# Altium schematic sheet Microcontroller_schematic.SchDoc
size B; SheetNumber: 1; SheetTotal: 1
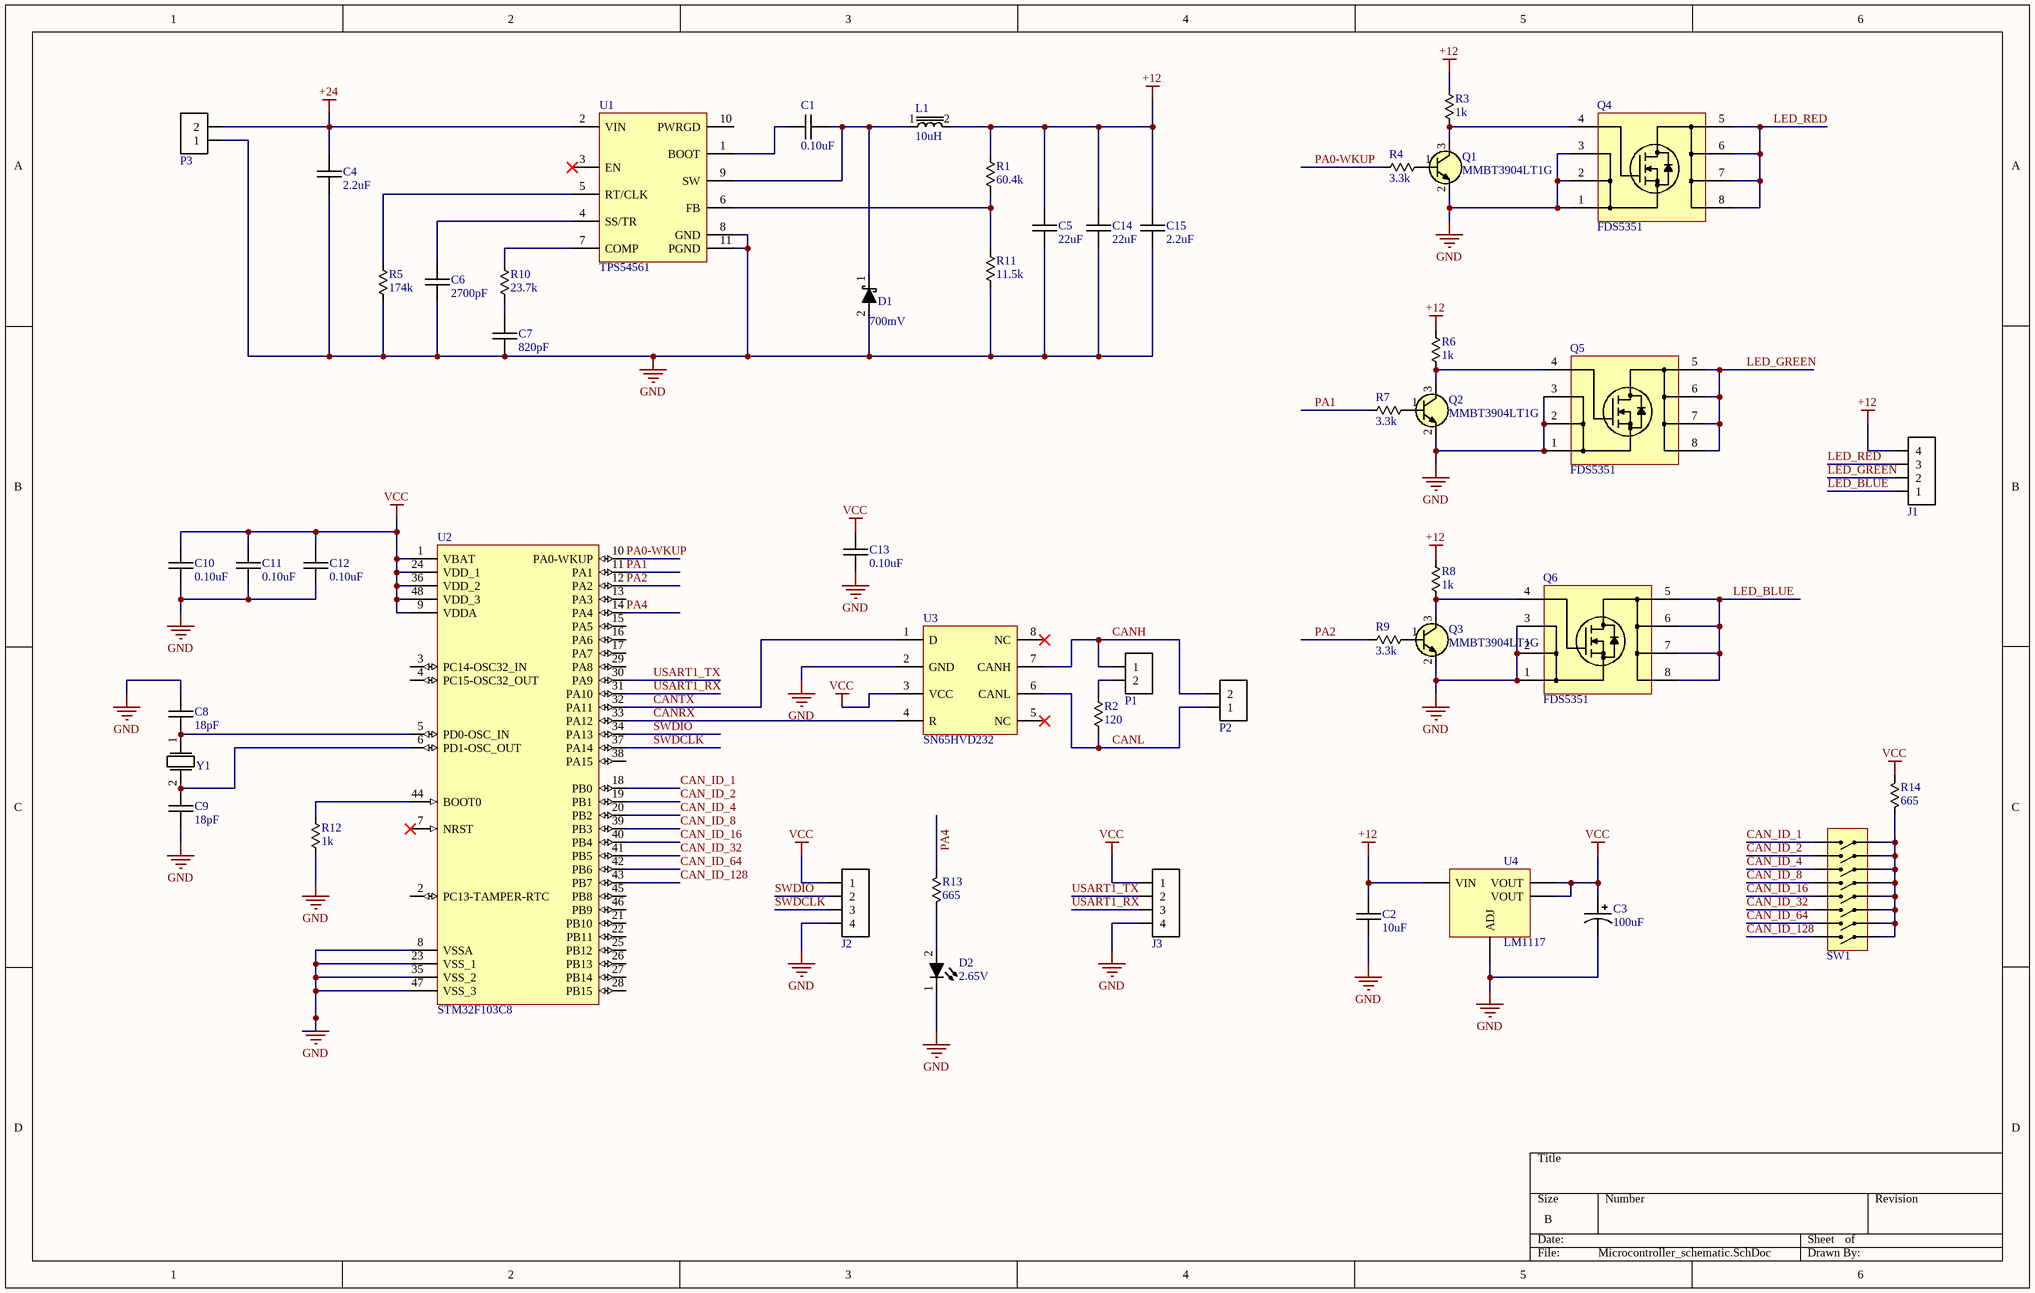
[diagram p0: Microcontroller_schematic.SchDoc]

## Parts
C1  0.10uF  [chip_0805]
C2  10uF  [chip_1206]
C3  100uF  [chip_2917_AVX_TAJD]
C4  2.2uF  [chip_1206]
C5  22uF  [chip_1206]
C6  2700pF  [chip_0805]
C7  820pF  [chip_0805]
C8  18pF  [chip_0603]
C9  18pF  [chip_0603]
C10  0.10uF  [chip_0805]
C11  0.10uF  [chip_0805]
C12  0.10uF  [chip_0805]
C13  0.10uF  [chip_0805]
C14  22uF  [chip_1206]
C15  2.2uF  [chip_1206]
D1  700mV  [do-214ab]
D2  2.65V  [chip_0603_LED]
J1  conn-4x1_0  [TERM_3.50MM_4x1_0]  (value not drawn)
J2  conn-4x1_0  [HDDR_4x1_0]  (value not drawn)
J3  conn-4x1_0  [HDDR_4x1_0]  (value not drawn)
L1  Inductance: 10uH  [VISHAY_IHLP3232DZ]  (hidden comment: ind_1)
P1  conn-2x1_0  [HDDR_2x1_0]  (value not drawn)
P2  conn-2x1_0  [TERM_3.50MM_2x1_0]  (value not drawn)
P3  conn-2x1_0  [TERM_3.50MM_2x1_0]  (value not drawn)
Q1  MMBT3904LT1G  [SOT-23-3_1]
Q2  MMBT3904LT1G  [SOT-23-3_1]
Q3  MMBT3904LT1G  [SOT-23-3_1]
Q4  FDS5351  [SO-8]
Q5  FDS5351  [SO-8]
Q6  FDS5351  [SO-8]
R1  60.4k  [chip_0805]
R2  120  [chip_0805]
R3  1k  [chip_0805]
R4  3.3k  [chip_0603]
R5  174k  [chip_0805]
R6  1k  [chip_0805]
R7  3.3k  [chip_0603]
R8  1k  [chip_0805]
R9  3.3k  [chip_0603]
R10  23.7k  [chip_0805]
R11  11.5k  [chip_0805]
R12  1k  [chip_0805]
R13  665  [chip_0805]
R14  665  [chip_0805]
SW1  DIP_SW_8  [A6S-8104-H]  (value not drawn)
U1  TPS54561  [WSON-10_0]
U2  STM32F103C8  [LQFP48_0]
U3  SN65HVD232  [SO-8]
U4  LM1117  [sot-223-4]
Y1  osc_xtal_2p_0  [ABLS_AT49_OSC]  (value not drawn)

## Nets
+12: C2.1 C5.1 C14.1 C15.1 J1.4 L1.2 R1.1 R3.1 R6.1 R8.1 U4.3(VIN)
+24: C4.1 P3.2 U1.2(VIN)
GND: C2.2 C3.2 C4.2 C5.2 C6.2 C7.2 C8.1 C9.2 C10.1 C11.2 C12.1 C13.1 C14.2 C15.2 D1.2 D2.1 J2.4 J3.4 P3.1 Q1.2(E) Q2.2(E) Q3.2(E) Q4.1(S) Q4.2(S) Q4.3(S) Q5.1(S) Q5.2(S) Q5.3(S) Q6.1(S) Q6.2(S) Q6.3(S) R5.2 R11.2 R12.2 U1.8(GND) U1.11(PGND) U2.8(VSSA) U2.23(VSS_1) U2.35(VSS_2) U2.47(VSS_3) U3.2(GND) U4.1(ADJ)
VCC: C3.1 C10.2 C11.1 C12.2 C13.2 J2.1 J3.1 R14.2 U2.1(VBAT) U2.9(VDDA) U2.24(VDD_1) U2.36(VDD_2) U2.48(VDD_3) U3.3(VCC) U4.2(VOUT) U4.4(VOUT)
CAN_ID_1: SW1.9 U2.18(PB0)
CAN_ID_2: SW1.10 U2.19(PB1)
CAN_ID_4: SW1.11 U2.20(PB2)
CAN_ID_8: SW1.12 U2.39(PB3)
CAN_ID_16: SW1.13 U2.40(PB4)
CAN_ID_32: SW1.14 U2.41(PB5)
CAN_ID_64: SW1.15 U2.42(PB6)
CAN_ID_128: SW1.16 U2.43(PB7)
CANH: P1.1 P2.2 U3.7(CANH)
CANL: P2.1 R2.2 U3.6(CANL)
CANRX: U2.33(PA12) U3.4(R)
CANTX: U2.32(PA11) U3.1(D)
LED_BLUE: J1.1 Q6.5(D) Q6.6(D) Q6.7(D) Q6.8(D)
LED_GREEN: J1.2 Q5.5(D) Q5.6(D) Q5.7(D) Q5.8(D)
LED_RED: J1.3 Q4.5(D) Q4.6(D) Q4.7(D) Q4.8(D)
PA0-WKUP: R4.2 U2.10(PA0-WKUP)
PA1: R7.2 U2.11(PA1)
PA2: R9.2 U2.12(PA2)
PA4: R13.2 U2.14(PA4)
SWDCLK: J2.3 U2.37(PA14)
SWDIO: J2.2 U2.34(PA13)
USART1_RX: J3.3 U2.31(PA10)
USART1_TX: J3.2 U2.30(PA9)
NetC1_1: C1.1 D1.1 L1.1 U1.9(SW)
NetC1_2: C1.2 U1.1(BOOT)
NetC6_1: C6.1 U1.4(SS/TR)
NetC7_1: C7.1 R10.2
NetC8_2: C8.2 U2.5(PD0-OSC_IN) Y1.1
NetC9_1: C9.1 U2.6(PD1-OSC_OUT) Y1.2
NetD2_2: D2.2 R13.1
NetP1_2: P1.2 R2.1
NetQ1_1: Q1.1(B) R4.1
NetQ1_3: Q1.3(C) Q4.4(G) R3.2
NetQ2_1: Q2.1(B) R7.1
NetQ2_3: Q2.3(C) Q5.4(G) R6.2
NetQ3_1: Q3.1(B) R9.1
NetQ3_3: Q3.3(C) Q6.4(G) R8.2
NetR1_2: R1.2 R11.1 U1.6(FB)
NetR5_1: R5.1 U1.5(RT/CLK)
NetR10_1: R10.1 U1.7(COMP)
NetR12_1: R12.1 U2.44(BOOT0)
NetR14_1: R14.1 SW1.1 SW1.2 SW1.3 SW1.4 SW1.5 SW1.6 SW1.7 SW1.8

Not connected (* = marked no-connect by the designer): U1 3(EN)* 10(PWRGD); U2 2(PC13-TAMPER-RTC) 3(PC14-OSC32_IN) 4(PC15-OSC32_OUT) 7(NRST)* 13(PA3) 15(PA5) 16(PA6) 17(PA7) 21(PB10) 22(PB11) 25(PB12) 26(PB13) 27(PB14) 28(PB15) 29(PA8) 38(PA15) 45(PB8) 46(PB9); U3 5(NC)* 8(NC)*

## Library data of the parts
C1 C10-C13 = CAP-00069: CAP, 0.10uF, 10%, 16V, X7R, 0805; Manufacturer: Murata; Manufacturer PN: GRM219R71C104KA01D; Part Number: CAP-00069; Capacitance: 0.10uF; Tolerance: 10%; Voltage Rating: 16V; Type: X7R
C2 = CAP-00539: CAP, 10uF, ±10%, 25V, X7R, 1206; Manufacturer: Samsung; Manufacturer PN: CL31B106KAHNNNE; Part Number: CAP-00539; Capacitance: 10uF; Tolerance: ±10%; Voltage Rating: 25V; Type: X7R
C3 = CAP-00550: CAP, 100uF, ±10%, 16V, Tantalum, 2917; Manufacturer: AVX; Manufacturer PN: TAJD107K016RNJ; Part Number: CAP-00550; Capacitance: 100uF; Tolerance: ±10%; Voltage Rating: 16V; Type: Tantalum; Cost: $0.94
C4 C15 = CAP-00563: CAP, 2.2uF, ±10%, 50V, X7R, 1206; Manufacturer: KEMET; Manufacturer PN: C1206C225K5RACTU; Part Number: CAP-00563; Capacitance: 2.2uF; Tolerance: ±10%; Voltage Rating: 50V; Type: X7R; Cost: $0.33
C5 C14 = CAP-00587: CAP, 22uF, ±10%, 25V, X5R, 1206; Manufacturer: Samsung Electro-Mechanics; Manufacturer PN: CL31A226KAHNNNE; Part Number: CAP-00587; Capacitance: 22uF; Tolerance: ±10%; Voltage Rating: 25V; Type: X5R; Cost: $0.41
C6 = CAP-00024: CAP, 2700pF, 10%, 50V, X7R, 0805; Manufacturer: Murata; Manufacturer PN: GRM216R71H272KA01D; Part Number: CAP-00024; Capacitance: 2700pF; Tolerance: 10%; Voltage Rating: 50V; Type: X7R
C7 = CAP-00008: CAP, 820pF, 10%, 50V, X7R, 0805; Manufacturer: Murata; Manufacturer PN: GRM216R71H821KA01D; Part Number: CAP-00008; Capacitance: 820pF; Tolerance: 10%; Voltage Rating: 50V; Type: X7R
C8 C9 = CAP-00409: CAP, 18pF, ±2%, 50V, C0G, 0603; Manufacturer: Murata; Manufacturer PN: GRM1885C1H180GA01D; Part Number: CAP-00409; Capacitance: 18pF; Tolerance: ±2%; Voltage Rating: 50V; Type: C0G
D1 = DIO-00048: Dio, Schottky, 5A, 700mV, 60V, SMC; Manufacturer: Diodes Incorporated; Manufacturer PN: B560C-13-F; Part Number: DIO-00048; Forward Voltage: 700mV; Reverse Breakdown Voltage: 60V; Current Rating: 5A; Type: Schottky; Cost: 0.5
D2 = DIO-00050: LED, Green, 0603, Low current, HELI2 Series; Manufacturer: Kingbright; Manufacturer PN: APT1608LZGCK; Reverse Breakdown Voltage: 5V; Power Rating: 120mW; Current Rating: 30mA; Part Number: DIO-00050; Forward Voltage: 2.65V; Type: LED; Cost: 0.58
J1 = CONN-00024: Term Blk, 4 Pos, 8A, 3.5mm Pitch, Screwless; Manufacturer: Phoenix Contact; Manufacturer PN: 1861959; Positions per level: 4; Levels: 1; Current: 8; Part Number: CONN-00024; Type: Terminal Block; Cost: 1.67; Weight: 2.3
J2 J3 = CONN-00029: Header 4x1, 0.1"; Positions per level: 4; Levels: 1; Part Number: CONN-00029; Type: Header
L1 = MAG-00106: Ind, 10uH, 20%, 5.2A (9A sat.), 0.0599 Ohm; Manufacturer: Vishay Dale; Manufacturer PN: IHLP3232DZER100M01; DCR: 59.9mOhm; Part Number: MAG-00106; Tolerance: 20%; Current Rating: 5.2A; Cost: 1.65
P1 = CONN-00055: Header, 2x1, 0.1"; Manufacturer: Samtec; Manufacturer PN: TSW-102-07-F-S; Positions per level: 2; Levels: 1; Part Number: CONN-00055; Type: Header; Cost: 0.2
P2 P3 = CONN-00023: Term Blk, 2 Pos, 8A, 3.5mm Pitch, Screwless; Manufacturer: Phoenix Contact; Manufacturer PN: 1861933; Positions per level: 2; Levels: 1; Current: 8; Part Number: CONN-00023; Type: Terminal Block; Cost: 0.79; Weight: 1.13
Q1-Q3 = XSTR-00037: XSTR, NPN, 200mA, 40V, Vce 0.3V, SOT-23-3; Manufacturer: ON Semi; Max Power: 300mW; Part Number: XSTR-00037; Max Voltage: 40V; Max Current: 200mA; Type: NPN; Vgs/Vce: 0.3V; Manufacturer PN: MMBT3904LT1G; Cost: 0.12
Q4-Q6 = XSTR-00034: XSTR NFET, 6.1A, 60V, 5W, SOIC-8; Manufacturer: ON Semi; Vgs/Vce: 2.0V; Part Number: XSTR-00034; Max Voltage: 60V; Max Current: 6.1A; Max Power: 5W; Type: NFET; Manufacturer PN: FDS5351; Cost: 0.8
R1 = RES-00531: RES SMD 60.4K OHM 1% 1/8W 0805; Manufacturer: Rohm Semiconductor; Manufacturer PN: KTR10EZPF6042; Power Rating: 0.125W; Part Number: RES-00531; Resistance: 60.4k; Tolerance: 1%
R2 = RES-00183: RES SMD 120 OHM 1% 1/8W 0805; Manufacturer: Rohm Semiconductor; Manufacturer PN: KTR10EZPF1200; Power Rating: 0.125W; Part Number: RES-00183; Resistance: 120; Tolerance: 1%
R3 R6 R8 R12 = RES-00361: RES SMD 1K OHM 1% 1/8W 0805; Manufacturer: Rohm Semiconductor; Manufacturer PN: KTR10EZPF1001; Power Rating: 0.125W; Part Number: RES-00361; Resistance: 1k; Tolerance: 1%
R4 R7 R9 = RES-00419: RES SMD 3.3K OHM 1% 1/4W 0603; Manufacturer: Panasonic; Manufacturer PN: ERJ-PA3F3301V; Power Rating: 0.25W; Part Number: RES-00419; Resistance: 3.3k; Tolerance: 1%
R5 = RES-00350: RES SMD 174K OHM 1% 1/8W 0805; Manufacturer: Rohm Semiconductor; Manufacturer PN: KTR10EZPF1743; Power Rating: 0.125W; Part Number: RES-00350; Resistance: 174k; Tolerance: 1%
R10 = RES-00392: RES SMD 23.7K OHM 1% 1/8W 0805; Manufacturer: Rohm Semiconductor; Manufacturer PN: KTR10EZPF2372; Power Rating: 0.125W; Part Number: RES-00392; Resistance: 23.7k; Tolerance: 1%
R11 = RES-00309: RES SMD 11.5K OHM 1% 1/8W 0805; Manufacturer: Rohm Semiconductor; Manufacturer PN: KTR10EZPF1152; Power Rating: 0.125W; Part Number: RES-00309; Resistance: 11.5k; Tolerance: 1%
R13 R14 = RES-00248: RES SMD 665 OHM 1% 1/8W 0805; Manufacturer: Rohm Semiconductor; Manufacturer PN: KTR10EZPF6650; Power Rating: 0.125W; Part Number: RES-00248; Resistance: 665; Tolerance: 1%
SW1 = MISC-00045: DIP Switch, 8 Switches, SMD, 25mA, 24V; Manufacturer: Omron; Part Number: MISC-00045; Manufacturer PN: A6S-8104-H; Cost: 2.85
U1 = PWREG-00033: REG, SW Buck Adj, 5A, 4.5-60V, 2.5MHz, TPS54561; Manufacturer: TI; Manufacturer PN: TPS54561DPRR; Voltage Range Out: 0.8-58.8V; Frequency: 100kHz-2.5MHz; Reg Type: SW Buck; Part Number: PWREG-00033; Voltage Range In: 4.5-60V; Max Current: 5A; Fixed/Adj: Adj; Cost: 5.52
U2 = UCTRL-00008: STM32 M3, LQFP-48; Manufacturer: ST; Part Number: UCTRL-00008; Manufacturer PN: STM32F103C8
U3 = IFACE-00008: CANbus Transceiver, Single channel, SN65HVD232; Manufacturer: TI; Manufacturer PN: SN65HVD232DR; Part Number: IFACE-00008; Cost: 2.01
U4 = PWREG-00018: REG, Linear, Fixed 3V3, 800mA, SOT-223; Manufacturer: TI; Manufacturer PN: LM1117MPX-3.3/NOPB; Voltage Range In: 4.5 - 15V; Voltage Range Out: 3.3V; Part Number: PWREG-00018; Max Current: 800mA; Reg Type: Linear; Fixed/Adj: Fixed; Cost: 1.14
Y1 = OSC-00002: XTAL, 8MHz, 18pF, 20ppm; Manufacturer: Abracon; Manufacturer PN: ABLS-8.000MHZ-B2-T; Frequency: 8.000M; ESR: 80; Stability: 50ppm; Part Number: OSC-00002; Load Capacitance: 18pF; Tolerance: 20ppm